# Altium schematic sheet V1.1.SchDoc
size 177 x 101 mm
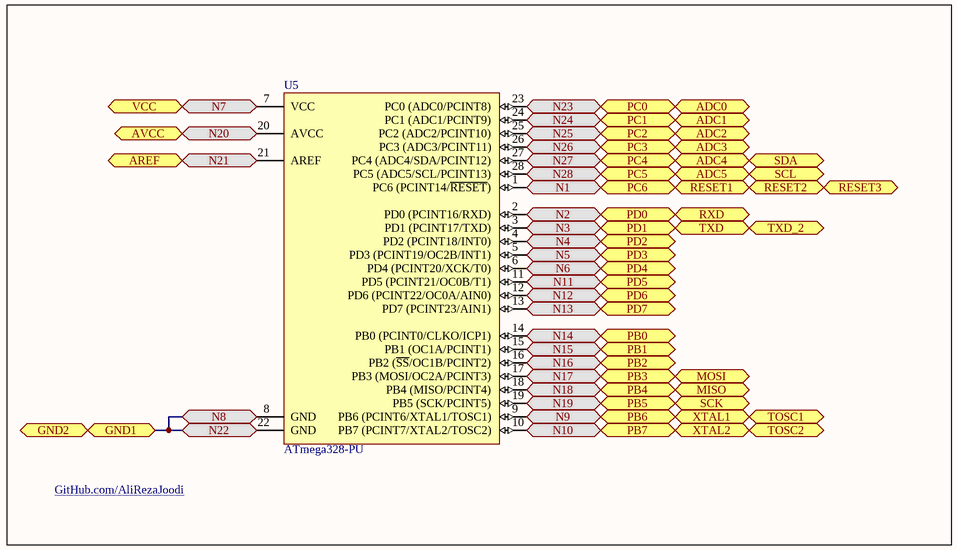
[diagram p0: V1.1.SchDoc]

## Parts
U5  ATmega328-PU  [28P3]

## Ports
ADC0, ADC1, ADC2, ADC3, ADC4, ADC5, AREF, AVCC, GND1, GND2, MISO, MOSI, N1 (bidir), N2 (bidir), N3 (bidir), N4 (bidir), N5 (bidir), N6 (bidir), N7 (bidir), N8 (bidir), N9 (bidir), N10 (bidir), N11 (bidir), N12 (bidir), N13 (bidir), N14 (bidir), N15 (bidir), N16 (bidir), N17 (bidir), N18 (bidir), N19 (bidir), N20 (bidir), N21 (bidir), N22 (bidir), N23 (bidir), N24 (bidir), N25 (bidir), N26 (bidir), N27 (bidir), N28 (bidir), PB0 (bidir), PB1 (bidir), PB2 (bidir), PB3 (bidir), PB4 (bidir), PB5 (bidir), PB6 (bidir), PB7 (bidir), PC0 (bidir), PC1 (bidir), PC2 (bidir), PC3 (bidir), PC4 (bidir), PC5 (bidir), PC6 (bidir), PD0 (bidir), PD1 (bidir), PD2 (bidir), PD3 (bidir), PD4 (bidir), PD5 (bidir), PD6 (bidir), PD7 (bidir), RESET1, RESET2, RESET3, RXD, SCK, SCL, SDA, TOSC1, TOSC2, TXD, TXD_2, VCC, XTAL1, XTAL2

## Nets
ADC0: U5.23(PC0_(ADC0/PCINT8)) ; port ADC0, port N23, port PC0
ADC1: U5.24(PC1_(ADC1/PCINT9)) ; port ADC1, port N24, port PC1
ADC2: U5.25(PC2_(ADC2/PCINT10)) ; port ADC2, port N25, port PC2
ADC3: U5.26(PC3_(ADC3/PCINT11)) ; port ADC3, port N26, port PC3
ADC4: U5.27(PC4_(ADC4/SDA/PCINT12)) ; port SDA, port ADC4, port N27, port PC4
ADC5: U5.28(PC5_(ADC5/SCL/PCINT13)) ; port SCL, port ADC5, port N28, port PC5
AREF: U5.21(AREF) ; port AREF, port N21
AVCC: U5.20(AVCC) ; port AVCC, port N20
GND1: U5.8(GND) U5.22(GND) ; port GND1, port GND2, port N8, port N22
MISO: U5.18(PB4_(MISO/PCINT4)) ; port MISO, port N18, port PB4
MOSI: U5.17(PB3_(MOSI/OC2A/PCINT3)) ; port MOSI, port N17, port PB3
N1: U5.1(PC6_(PCINT14/~{RESET})) ; port RESET1, port RESET2, port RESET3, port N1, port PC6
N2: U5.2(PD0_(PCINT16/RXD)) ; port RXD, port N2, port PD0
N3: U5.3(PD1_(PCINT17/TXD)) ; port TXD, port TXD_2, port N3, port PD1
N4: U5.4(PD2_(PCINT18/INT0)) ; port N4, port PD2
N5: U5.5(PD3_(PCINT19/OC2B/INT1)) ; port N5, port PD3
N6: U5.6(PD4_(PCINT20/XCK/T0)) ; port N6, port PD4
N7: U5.7(VCC) ; port VCC, port N7
N9: U5.9(PB6_(PCINT6/XTAL1/TOSC1)) ; port XTAL1, port TOSC1, port N9, port PB6
N10: U5.10(PB7_(PCINT7/XTAL2/TOSC2)) ; port XTAL2, port TOSC2, port N10, port PB7
N11: U5.11(PD5_(PCINT21/OC0B/T1)) ; port N11, port PD5
N12: U5.12(PD6_(PCINT22/OC0A/AIN0)) ; port N12, port PD6
N13: U5.13(PD7_(PCINT23/AIN1)) ; port N13, port PD7
N14: U5.14(PB0_(PCINT0/CLKO/ICP1)) ; port N14, port PB0
N15: U5.15(PB1_(OC1A/PCINT1)) ; port N15, port PB1
N16: U5.16(PB2_(~{SS}/OC1B/PCINT2)) ; port N16, port PB2
N19: U5.19(PB5_(SCK/PCINT5)) ; port SCK, port N19, port PB5

## Notes on the sheet
- GitHub.com/AliRezaJoodi

## Library data of the parts
U5 = ATmega328-PU: 8-bit AVR Microcontroller, 32KB Flash, 1KB EEPROM, 2KB SRAM, 28-pin PDIP, Industrial Grade (-40°C to 85°C); Published: 1-Apr-2010; DatasheetVersion: revA, Jan-2010; PackageVersion: revB, Sep-2001; PackageReference: 28P3; Publisher: Altium Limited; PackageDescription: 28-lead (0.300"/7.62mm Wide) Plastic Dual Inline Package (PDIP); Supplier 1: Digi-Key; Supplier Part Number 1: ATMEGA328-PU-ND; Supplier 2: Mouser; Supplier Part Number 2: 556-ATMEGA328-PU; ComponentLink1Description: Manufacturer Link; ComponentLink1URL: http://www.atmel.com/products/avr/default.asp?; ComponentLink2Description: ATmega48A/48PA/88A/88PA/168A/168PA/328/328P Datasheet; ComponentLink2URL: http://www.atmel.com/dyn/resources/prod_documents/8271.pdf; ComponentLink3Description: ATmega48A/48PA/88A/88PA/168A/168PA/328/328P Summary; ComponentLink3URL: http://www.atmel.com/dyn/resources/prod_documents/8271S.pdf; ComponentLink4Description: Atmel.com Home; ComponentLink4URL: http://www.atmel.com